# EasyEDA schematic SCH_PCB_Project.json

## Sheets
1 Sheet_1: TITLE: SYSTEM 1: ARGON AND SENSOR; REV: 1.0; Date: 2022-05-24; Sheet: 1/1; Drawn By: GIA PHU; Company: DEAKIN UNIVERSITY
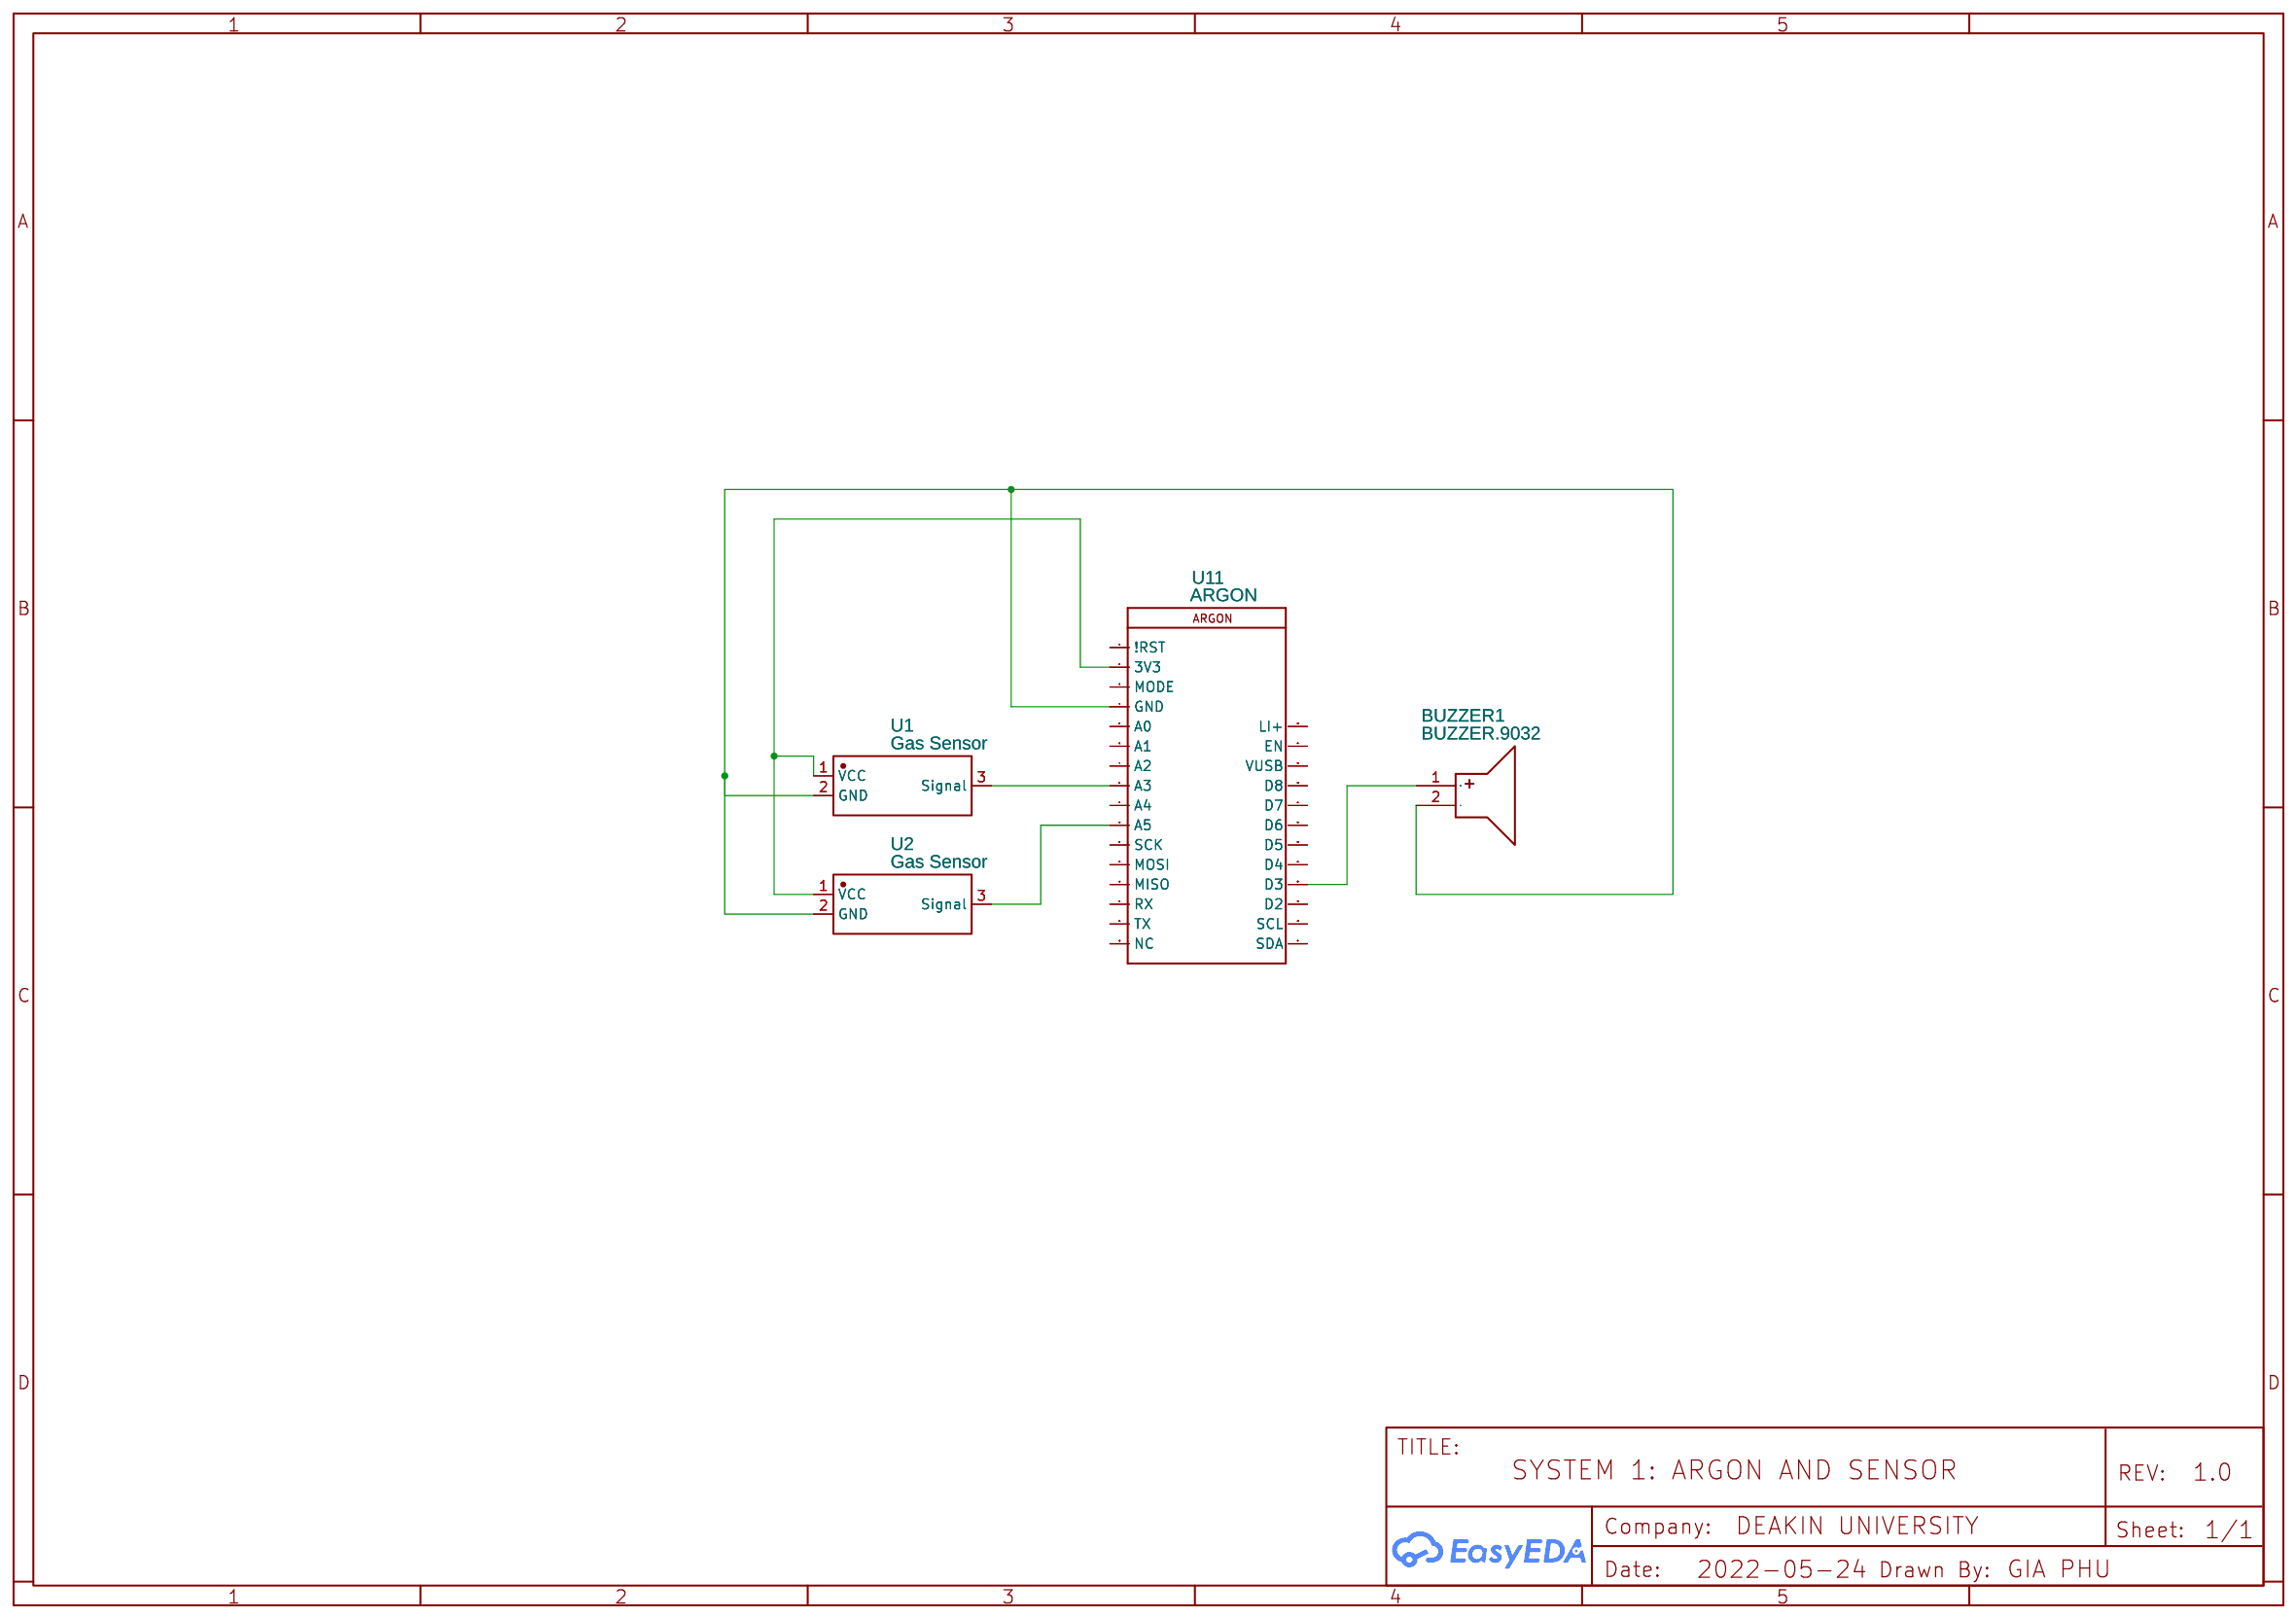
[diagram p0: Sheet_1]
2 Sheet_2: TITLE: SYSTEM 2: RASPBERRY PI MONITOR AND RELAY
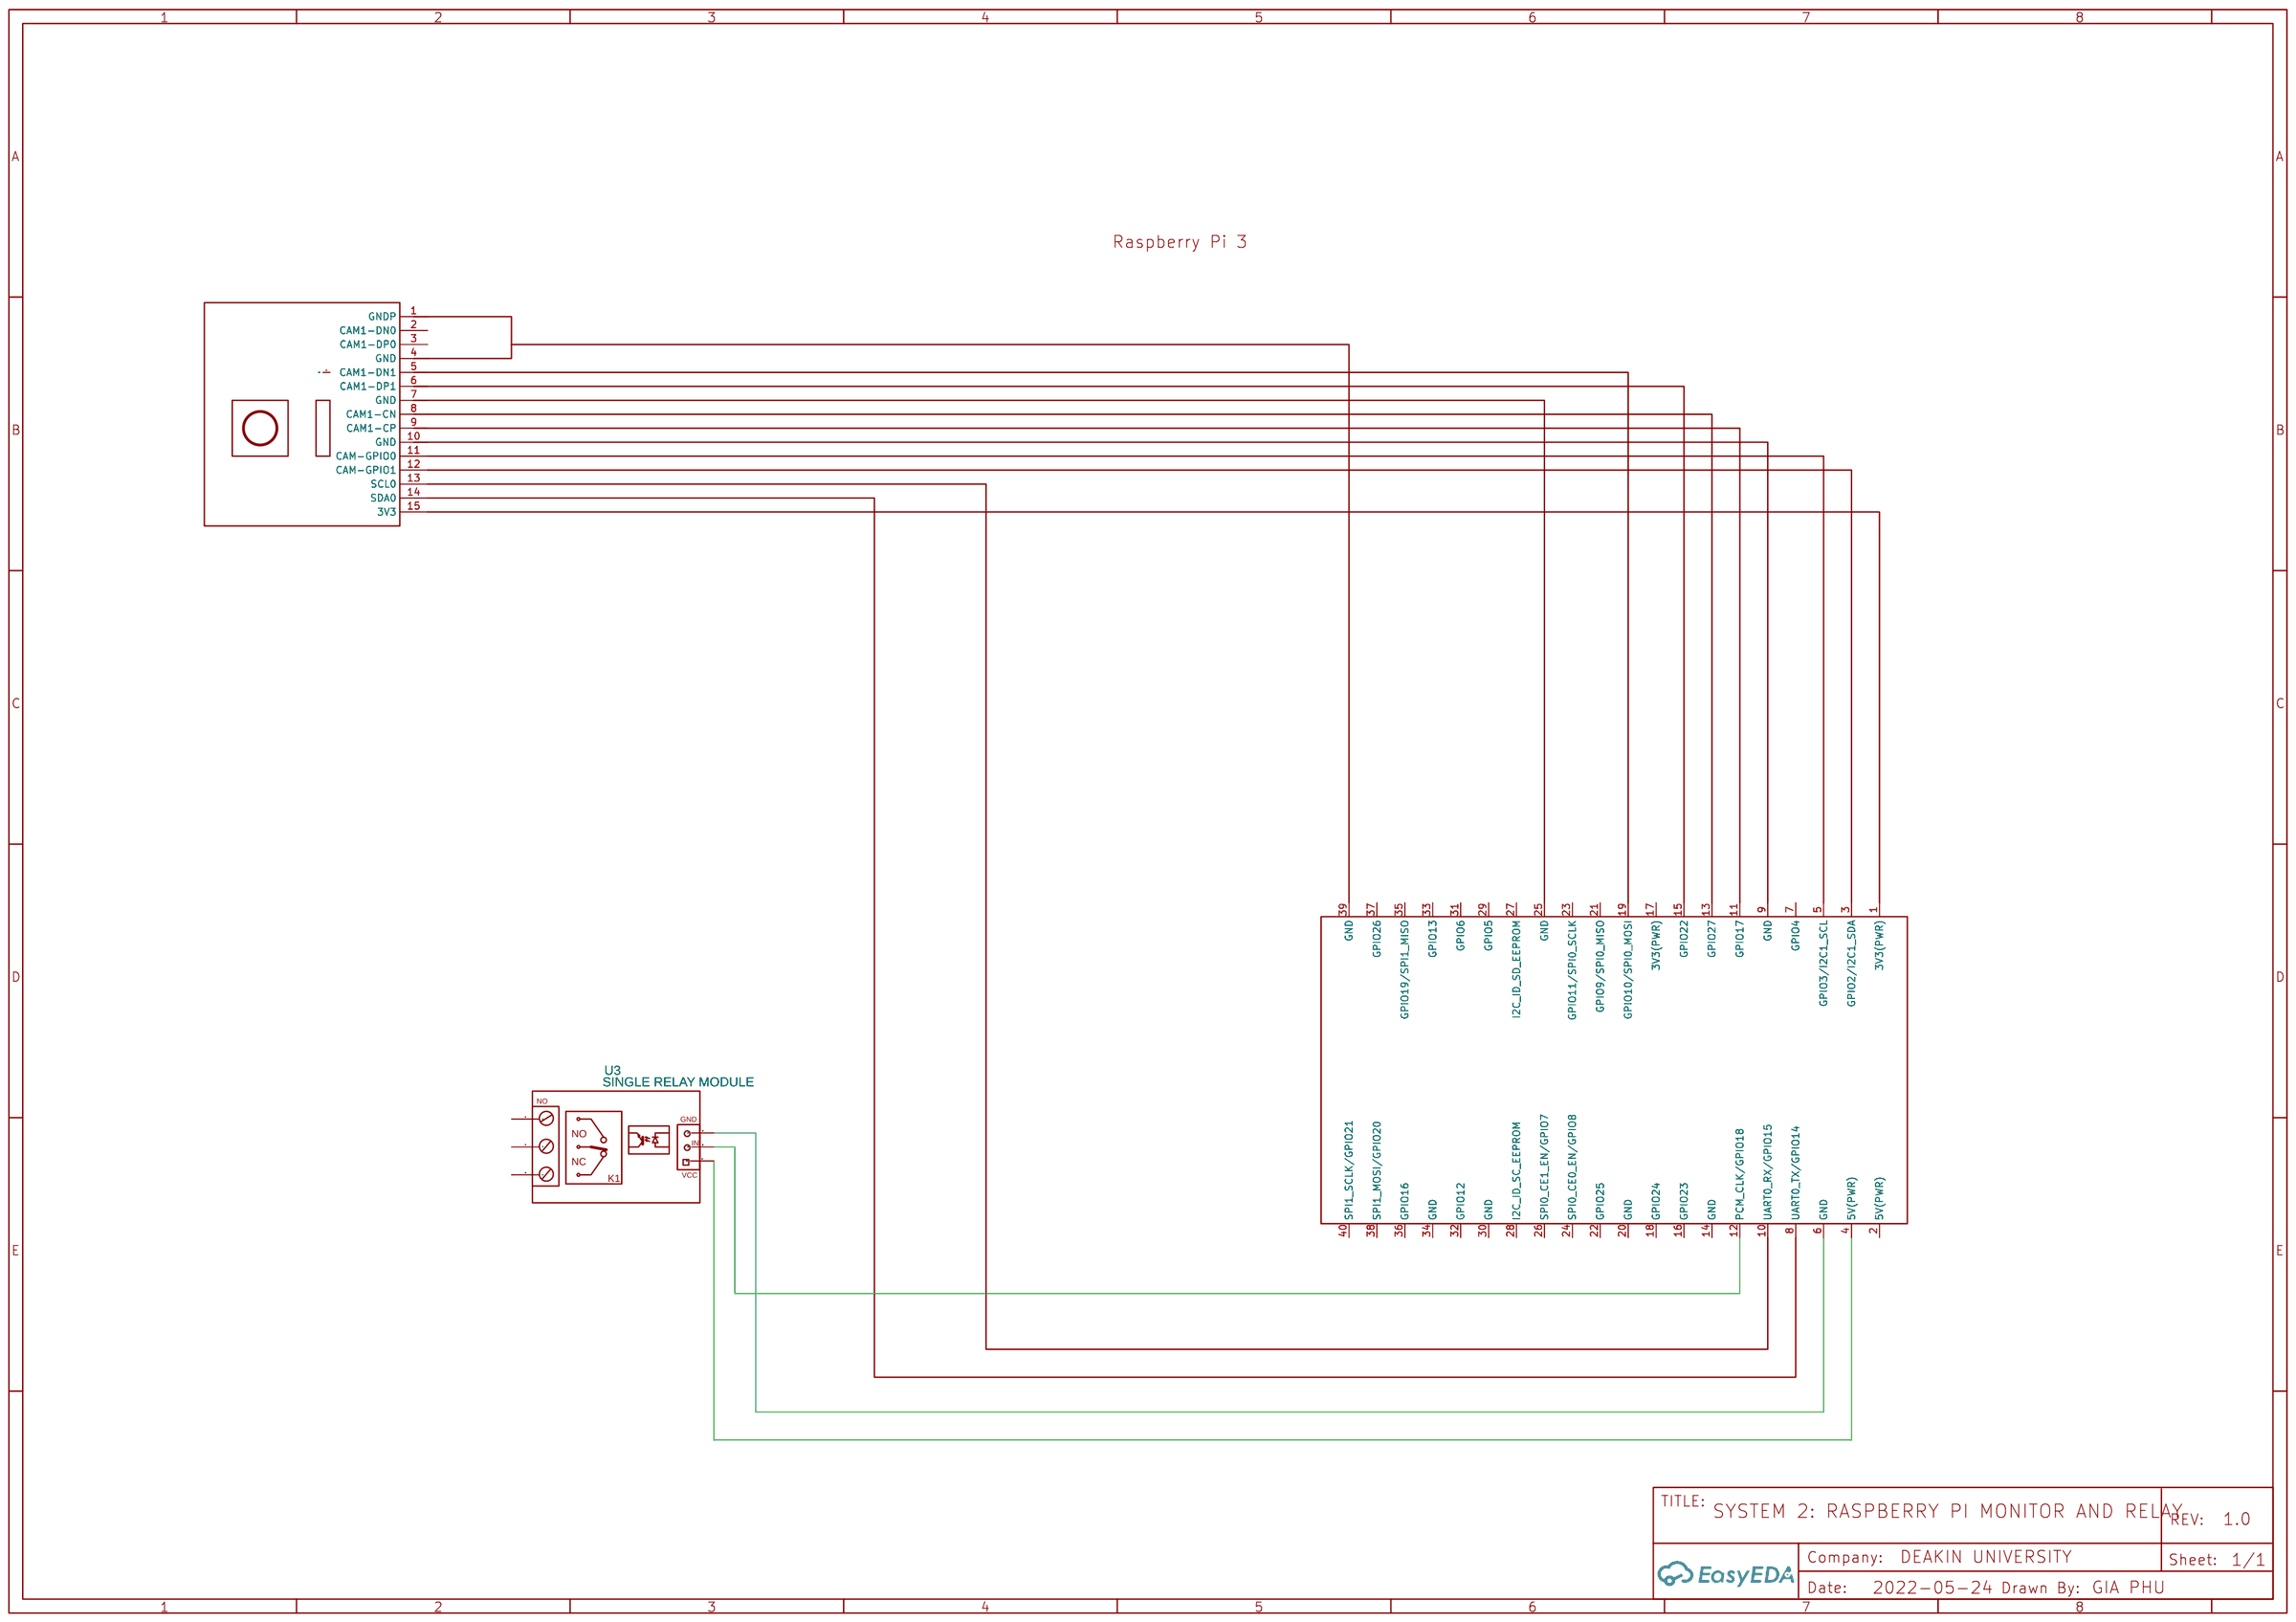
[diagram p1: Sheet_2]
3 Sheet_3: TITLE: SYSTEM 3: RASPBERRY PI CONTROL
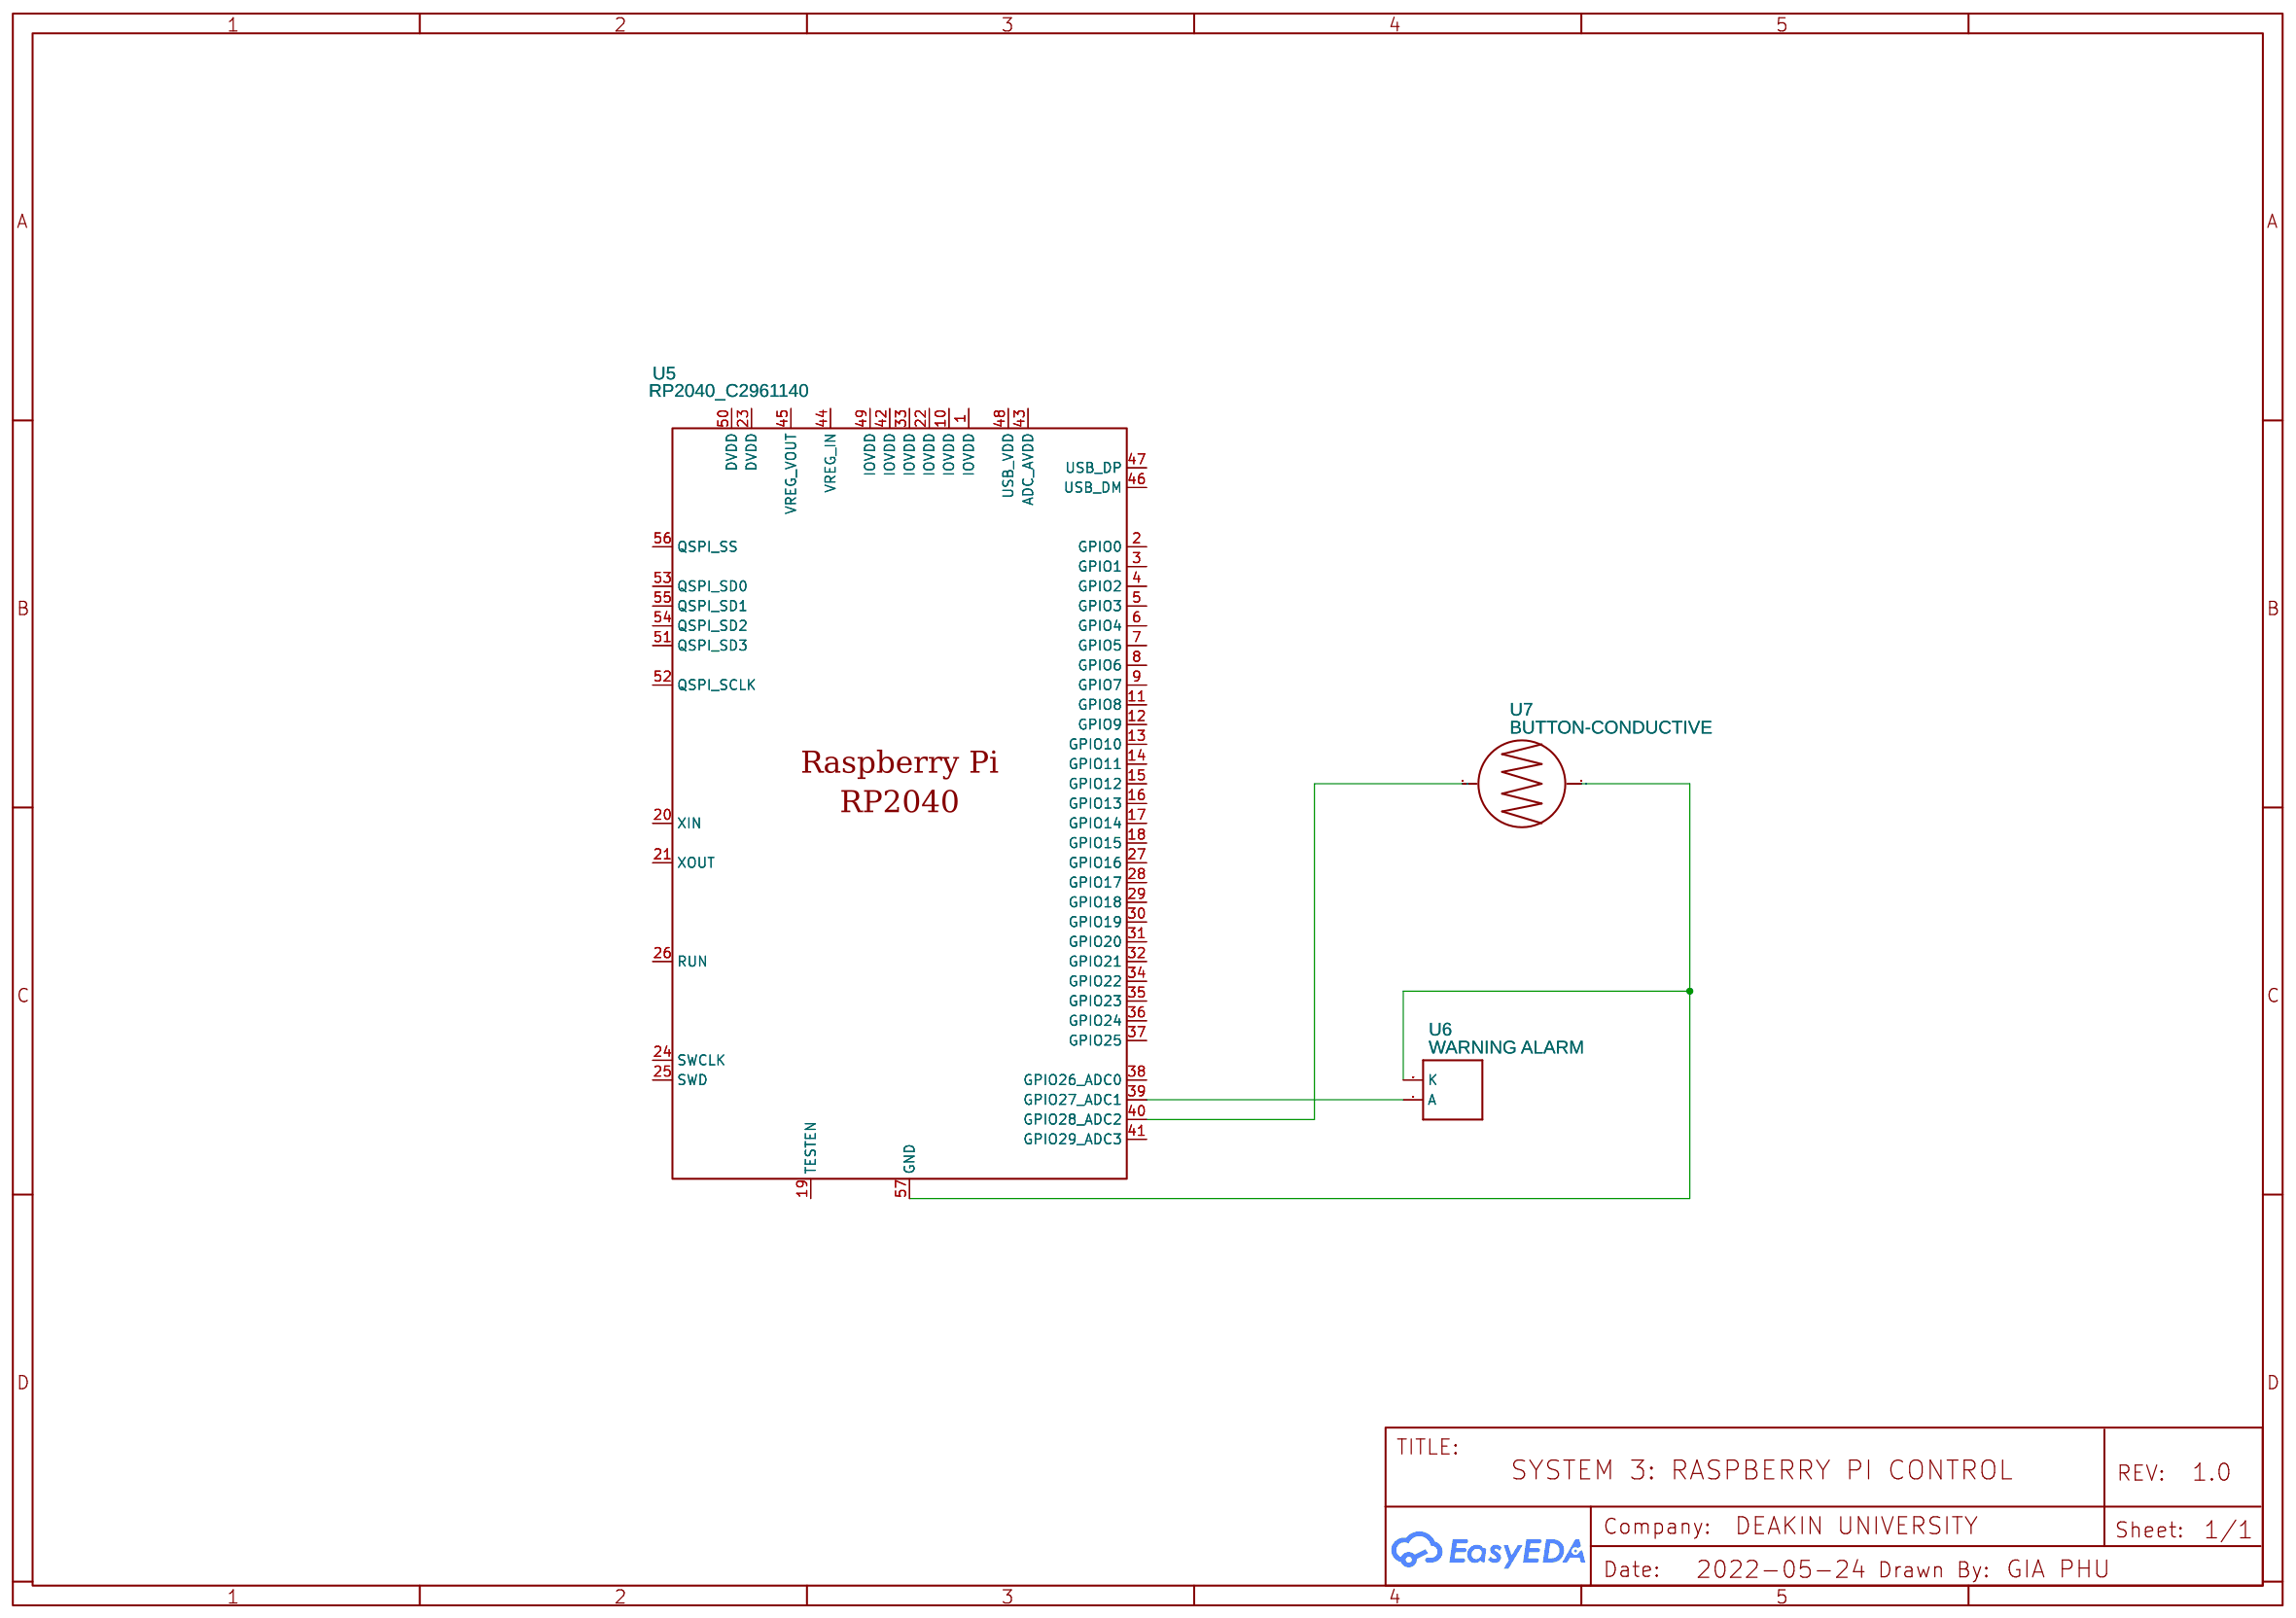
[diagram p2: Sheet_3]

## Parts
sheet Sheet_1
BUZZER1  BUZZER.9032  [BUZ-SMD_2P-L10.5-W9.0-P10.50-R]
U1  Gas Sensor  [SENSOR-TH_D210HM]
U2  Gas Sensor  [SENSOR-TH_D210HM]
U11  ARGON  [ARGON]
sheet Sheet_2
U3  SINGLE RELAY MODULE  [RELAY MODULE 1 RELAYS]
U4  raspberry pi3 and picamera_MIO
sheet Sheet_3
U5  RP2040_C2961140  [QFN-56_L7.0-W7.0-P0.40-TL-EP4.0]
U6  WARNING ALARM  [LCD_BACKLIGHT_PADS]
U7  BUTTON-CONDUCTIVE  [BUTTON-CONDUCTIVE]

## Library data of the parts
BUZZER1 = BUZZER.9032: Supplier: LCSC; Supplier Part: C9900002564; Contributor: LCSC; JLCPCB Part Class: Extended Part
U1 U2 = D210HM: Supplier: LCSC; Supplier Part: C9900004476; Manufacturer: null; JLCPCB Part Class: Extended Part; Contributor: LCSC
U11 = ARGON: Contributor: HELJO Industries
U3 = SINGLE RELAY MODULE: Manufacturer Part: 1-Channel 5V Relay Module w/ Opto-isolator; Supplier Part: SKU: 223429; link: http://www.volumerate.com/product/1-channel-5v-relay-module-w-opto-isolator-red-blue-223429; Contributor: Ahmad Aidit
U4 = raspberry pi3 and picamera_MIO: Contributor: Cellista_33
U5 = RP2040_C2961140: Supplier: LCSC; Supplier Part: C2961140; Manufacturer: Raspberry Pi(树莓派); Manufacturer Part: RP2040; Contributor: LCSC
U6 = LCD_BACKLIGHT_PADS: Contributor: SparkFun
U7 = BUTTON-CONDUCTIVE: Contributor: SparkFun

## Nets
Net-(BUZZER1-1): BUZZER1.1(+) U11.20(D3)
Net-(BUZZER1-2): BUZZER1.2(-) U1.2(GND) U2.2(GND) U11.4(GND)
Net-(U1-1): U1.1(VCC) U2.1(VCC) U11.2(3V3)
Net-(U1-3): U1.3(Signal) U11.8(A3)
Net-(U2-3): U2.3(Signal) U11.10(A5)
Net-(U3-13): U3.13 U4.4(5V(PWR))
Net-(U3-14): U3.14 U4.6(GND)
Net-(U3-15): U3.15 U4.12(PCM_CLK/GPIO18)
Net-(U5-39): U5.39(GPIO27_ADC1) U6.P$1(A)
Net-(U5-40): U5.40(GPIO28_ADC2) U7.1
Net-(U5-57): U5.57(GND) U6.P$2(K) U7.2

Not connected (* = marked no-connect by the designer): U3 1 2 3; U4 1(3V3(PWR)) 2(5V(PWR)) 3(GPIO2/I2C1_SDA) 5(GPIO3/I2C1_SCL) 7(GPIO4) 8(UART0_TX/GPIO14) 9(GND) 10(UART0_RX/GPIO15) 11(GPIO17) 13(GPIO27) 14(GND) 15(GPIO22) 16(GPIO23) 17(3V3(PWR)) 18(GPIO24) 19(GPIO10/SPI0_MOSI) 20(GND) 21(GPIO9/SPI0_MISO) 22(GPIO25) 23(GPIO11/SPI0_SCLK) 24(SPI0_CE0_EN/GPIO8) 25(GND) 26(SPI0_CE1_EN/GPIO7) 27(I2C_ID_SD_EEPROM) 28(I2C_ID_SC_EEPROM) 29(GPIO5) 30(GND) 31(GPIO6) 32(GPIO12) 33(GPIO13) 34(GND) 35(GPIO19/SPI1_MISO) 36(GPIO16) 37(GPIO26) 38(SPI1_MOSI/GPIO20) 39(GND) 40(SPI1_SCLK/GPIO21); U5 1(IOVDD) 2(GPIO0) 3(GPIO1) 4(GPIO2) 5(GPIO3) 6(GPIO4) 7(GPIO5) 8(GPIO6) 9(GPIO7) 10(IOVDD) 11(GPIO8) 12(GPIO9) 13(GPIO10) 14(GPIO11) 15(GPIO12) 16(GPIO13) 17(GPIO14) 18(GPIO15) 19(TESTEN) 20(XIN) 21(XOUT) 22(IOVDD) 23(DVDD) 24(SWCLK) 25(SWD) 26(RUN) 27(GPIO16) 28(GPIO17) 29(GPIO18) 30(GPIO19) 31(GPIO20) 32(GPIO21) 33(IOVDD) 34(GPIO22) 35(GPIO23) 36(GPIO24) 37(GPIO25) 38(GPIO26_ADC0) 41(GPIO29_ADC3) 42(IOVDD) 43(ADC_AVDD) 44(VREG_IN) 45(VREG_VOUT) 46(USB_DM) 47(USB_DP) 48(USB_VDD) 49(IOVDD) 50(DVDD) 51(QSPI_SD3) 52(QSPI_SCLK) 53(QSPI_SD0) 54(QSPI_SD2) 55(QSPI_SD1) 56(QSPI_SS); U11 1(!RST) 3(MODE) 5(A0) 6(A1) 7(A2) 9(A4) 11(SCK) 12(MOSI) 13(MISO) 14(RX) 15(TX) 16(NC) 17(SDA) 18(SCL) 19(D2) 21(D4) 22(D5) 23(D6) 24(D7) 25(D8) 26(VUSB) 27(EN) 28(LI+)
